# Altium schematic sheet SBC Interface.SchDoc: Single Board Computer Interface
size 228 x 165 mm; DrawnBy: Joseph Riesen; DocumentNumber: 8; Revision: 1.0; SheetNumber: 8; SheetTotal: 10
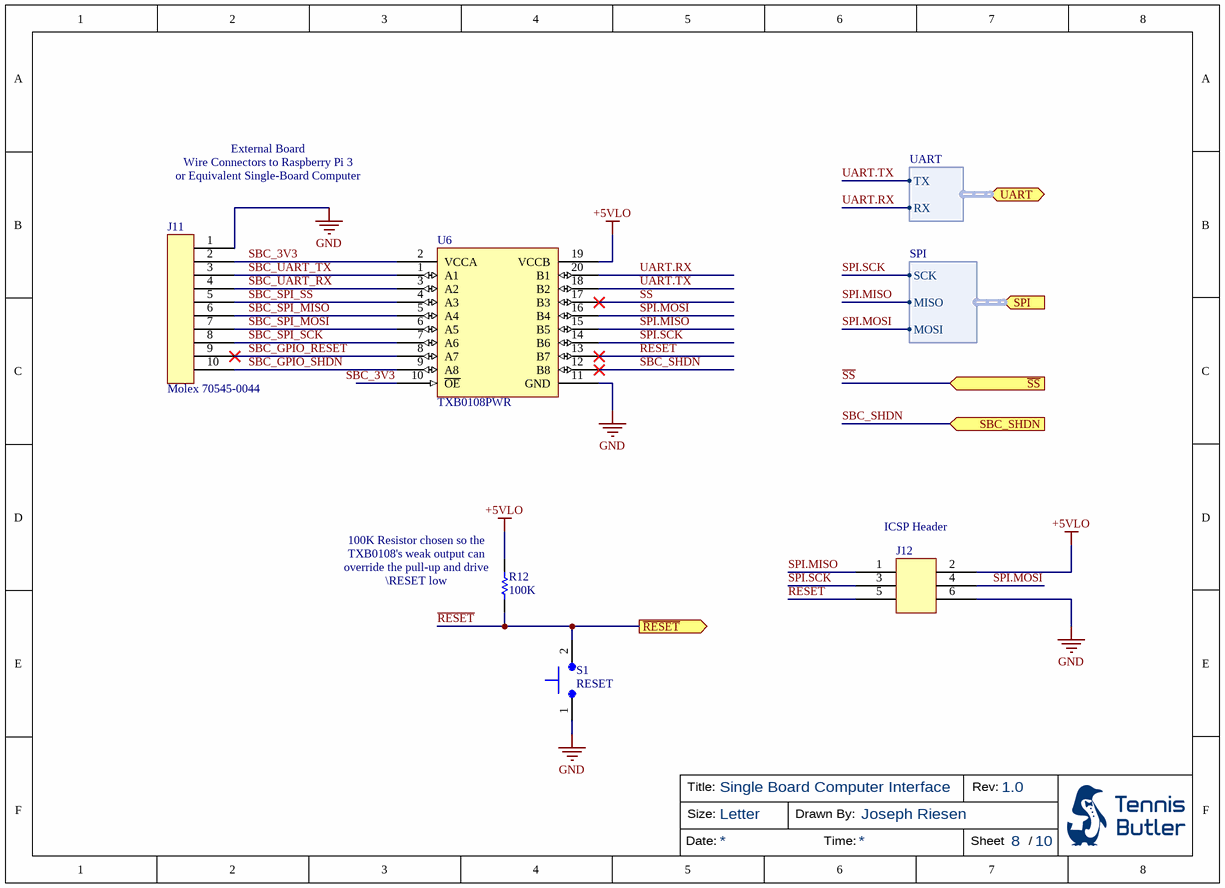
[diagram p0: SBC Interface.SchDoc]

## Parts
J11  Molex 70545-0044  [Molex 70545-0044]
J12  ICSP  [Molex 70287-1099]  (value not drawn)
R12  100K  [RESC2013X70X40ML20T20]
S1  RESET  [E-Switch TL9210 Series Tact Switch]
U6  TXB0108PWR  [TSOP65P640X120-20M]

## Ports
SBC_SHDN (in), SPI (in, harness SPI), UART (bidir, harness UART), ~{RESET} (out), ~{SS} (in)

## Harnesses
SPI: MISO, MOSI, SCK
UART: TX, RX

## Nets
+5VLO: J12.2 R12.2 U6.19(VCCB)
GND: J11.1 J12.6 S1.1 U6.11(GND)
~{RESET}: J12.5 R12.1 S1.2 U6.13(B7) ; port ~{RESET}
~{SS}: U6.17(B3) ; port ~{SS}
SBC_3V3: J11.2 U6.2(VCCA) U6.10(~{OE})
SBC_GPIO_RESET: J11.9 U6.8(A7)
SBC_GPIO_SHDN: J11.10 U6.9(A8)
SBC_SHDN: U6.12(B8) ; port SBC_SHDN
SBC_SPI_MISO: J11.6 U6.5(A4)
SBC_SPI_MOSI: J11.7 U6.6(A5)
SBC_SPI_SCK: J11.8 U6.7(A6)
SBC_SPI_SS: J11.5 U6.4(A3)
SBC_UART_RX: J11.4 U6.3(A2)
SBC_UART_TX: J11.3 U6.1(A1)
SPI.MISO: J12.1 U6.15(B5) ; port SPI.MISO
SPI.MOSI: J12.4 U6.16(B4) ; port SPI.MOSI
SPI.SCK: J12.3 U6.14(B6) ; port SPI.SCK
UART.RX: U6.20(B1) ; port UART.RX
UART.TX: U6.18(B2) ; port UART.TX

## Notes on the sheet
- External Board
  Wire Connectors to Raspberry Pi 3
  or Equivalent Single-Board Computer
- (near J12) ICSP Header
- (near R12) 100K Resistor chosen so the TXB0108's weak output can override the pull-up and drive \RESET low
- Title:
- Size:
- Letter
- Drawn By:
- Rev:
- Date:
- Time:
- Sheet
- /

## Library data of the parts
J11 = Molex 70545-0044 SL 10-Pin Header: CONN HEADER VERT 10POS 2.54MM, PEG; Contact Resistance: 30mR; Number of Positions: 10; Current Rating: 3A; Voltage Rating: 250V; Insulation Resistance: 1GR; Gender: Female; Glow Wire Compliant: Non-compliant; Supplier 1: Digi-Key; Manufacturer: Molex; Manufacturer Part Number: 70545-0044; Stock 1: 559; Pricing 1: 1 = 2.16000, 10 = 1.96000, 100 = 1.68000, 500 = 1.40000, 1000 = 1.20000, 5000 = 1.06400 (USD); RoHS 1: Yes; Mount: Through Hole; Contact Material: Bronze; Contact Plating: Gold; Housing Material: Thermoplastic; Color: Black; Material: Brass; Min Operating Temperature: -40°C; Max Operating Temperature: 105°C; Number of Rows: 1; Packaging: Rail/Tube; Termination: Through Hole; Number of Contacts: 10; Orientation: Vertical; Package Quantity: 768; Contact Gender: Male; Number of Circuits: 10; Voltage Rating (DC): 250V; Pitch: 2.54mm; REACH SVHC: Unknown; ELV: Compliant; Flammability Rating: UL94 V-0; ComponentLink1URL: https://datasheet.ciiva.com/5159/0705450044-pcb-headers-172681-5159521.pdf?src-supplier=Mouser; ComponentLink1Description: Datasheet 1 (Mouser); ComponentLink2URL: https://datasheet.ciiva.com/30114/22600705450044-pcb-headers-30114382.pdf?src-supplier=Onlinecomponents.com; ComponentLink2Description: Datasheet 2 (Onlinecomponents.com); Supplier Part Number 1: WM4150-ND
J12 = Molex 70287-1099 6-Pin (3x2) Male Header: CONN HEADER BKWY DL GOLD 6POS; Manufacturer: Molex; Manufacturer Part Number: 0702871099; Number of Positions: 6; Max Voltage Rating (DC): 250V; Connector Type: Male Pin; Pitch: 2.54mm; Row Spacing: 0.1inch; Supplier 1: Digi-Key; Stock 1: 0; RoHS 1: Yes; Mount: Through Hole; Contact Plating: Gold; Contact Material: Brass; Housing Material: Thermoplastic; Color: Black; Housing Color: Black; Min Operating Temperature: -40°C; Max Operating Temperature: 120°C; Orientation: Straight; Packaging: Bulk; Number of Rows: 2; Termination: Solder; Number of Contacts: 6; Length: 7.62mm; Contact Mating Length: 0.24inch; Depth: 5.08mm; Radiation Hardening: No; ComponentLink1URL: https://datasheet.ciiva.com/9470/0702871099-pcb-headers-9470351.pdf?src-supplier=Avnet; ComponentLink1Description: Datasheet 1 (Avnet); ComponentLink2URL: https://datasheet.ciiva.com/2961/702871098-sd-2961401.pdf?src-supplier=Digi-Key; ComponentLink2Description: Datasheet 2 (Digi-Key); Supplier Part Number 1: 0702871099-ND
R12 = CMP-2001-04377-1: RES SMD 100K OHM 1% 1/8W 0805; Part Number: ERJ-6ENF1003V; Manufacturer: Panasonic
S1 = E-Switch TL9210 Series Tact Switch: SWITCH TACTILE SPST-NO 0.05A 12V; Manufacturer Part Number: TL9210AF260Q; Mechanical Life: 100000Cycles; Illumination Type: Non-Illuminated; Operating Force: 260gf; Throw Configuration: SPST; Switch Travel: 1.3mm; Switch Function: Off-Mom; Supplier 1: Digi-Key; Manufacturer: E-Switch; Stock 1: 4135; Pricing 1: 1 = 0.59000, 10 = 0.56400, 25 = 0.55400, 50 = 0.53300, 100 = 0.45980, 250 = 0.41804, 500 = 0.39712 (USD); RoHS 1: Yes; Mount: Surface Mount; Min Operating Temperature: -20°C; Max Operating Temperature: 70°C; Packaging: Tape and Reel; Termination: Gull Wing; Lead Free: Lead Free; ComponentLink1URL: http://www.mouser.com/ds/2/140/e-switch_TL9210-371502.pdf?src-supplier=Mouser; ComponentLink1Description: Datasheet 1 (Mouser); ComponentLink2URL: https://media.digikey.com/pdf/Data%20Sheets/E-Switch%20PDFs/TL9210.pdf?src-supplier=Digi-Key; ComponentLink2Description: Datasheet 2 (Digi-Key); Supplier Part Number 1: EG2664CT-ND
U6 = TXB0108PWR: IC, TRANSLATOR, 8BIT, BIDIRECTIONAL; Manufacturer: Texas Instruments; Max Supply Voltage: 5.5V; Min Supply Voltage: 1.65V; Propagation Delay: 4ns; Number of Channels: 8; High Level Output Current: -20uA; Low Level Output Current: 20uA; Data Rate: 100Mbps; Turn-On Delay Time: 9.5ns; Quiescent Current: 3.5uA; Rise Time: 7.3ns; Supplier 1: Digi-Key; Manufacturer Part Number: TXB0108PWR; Stock 1: 47771; Pricing 1: 1 = 1.55000, 10 = 1.39200, 100 = 1.11890, 500 = 0.91928, 1000 = 0.76169 (USD); RoHS 1: Yes; Mount: Surface Mount; Case/Package: TSSOP; Number of Pins: 20; Weight: 0.002716oz; Contact Plating: Gold; Min Operating Temperature: -40°C; Max Operating Temperature: 85°C; Packaging: Tape and Reel; Package Quantity: 1; Logic Function: Translator; Number of Bits: 8; Number of Inputs: 8; Output Current: 20uA; Termination: SMD/SMT; Length: 6.5mm; Height: 1.15mm; Width: 4.4mm; Radiation Hardening: No; Lead Free: Lead Free; REACH SVHC: No SVHC; ComponentLink1Description: Datasheet; ComponentLink1URL: http://www.ti.com/lit/ds/symlink/txb0108.pdf; Supplier Part Number 1: 296-21527-1-ND